# Altium schematic sheet agent-mother-sensor.SchDoc: TVMD Agent Controller Sensors
size A4; Author: Sciyen; DocumentNumber: 2; SheetNumber: 2; SheetTotal: 2
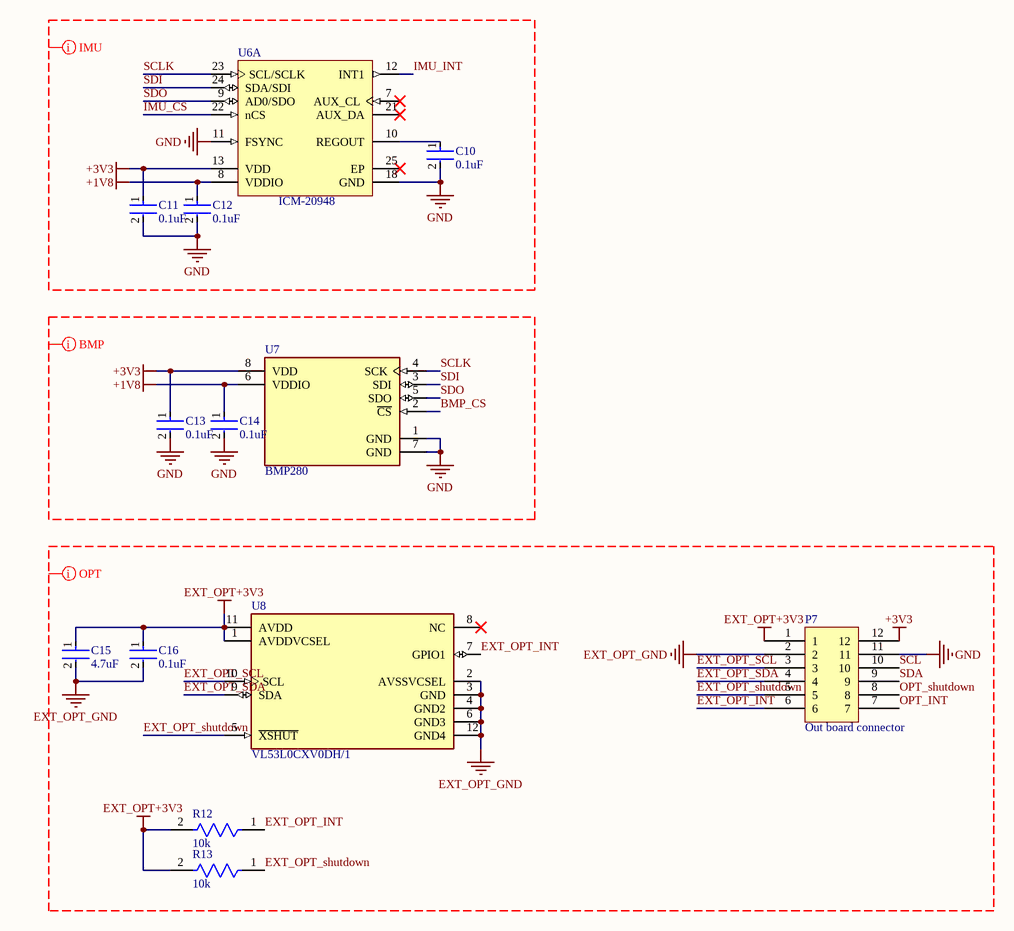
[diagram p0: agent-mother-sensor.SchDoc]

## Parts
C10  0.1uF  [FP-C0402-BB-MFG]
C11  0.1uF  [FP-C0402-BB-MFG]
C12  0.1uF  [FP-C0402-BB-MFG]
C13  0.1uF  [FP-C0402-BB-MFG]
C14  0.1uF  [FP-C0402-BB-MFG]
C15  4.7uF  [FP-C0402-BB-MFG]
C16  0.1uF  [FP-C0402-BB-MFG]
P7  Out board connector  [Edge Connector]
R12  10k  [FP-CRCW0402-e3-IPC_A]
R13  10k  [FP-CRCW0402-e3-IPC_A]
U6  ICM-20948  [TDK-QFN-24_L]  (part A of 2)
U7  BMP280  [FP-BMP280-MFG]
U8  VL53L0CXV0DH/1  [FP-LGA-12-MFG]

## Nets
+1V8: C12.1 C14.1 U6.8(VDDIO) U7.6(VDDIO)
+3V3: C11.1 C13.1 P7.12 U6.13(VDD) U7.8(VDD)
EXT_OPT+3V3: C15.1 C16.1 P7.1 R12.2 R13.2 U8.1(AVDDVCSEL) U8.11(AVDD)
EXT_OPT_GND: C15.2 C16.2 P7.2 U8.2(AVSSVCSEL) U8.3(GND) U8.4(GND2) U8.6(GND3) U8.12(GND4)
GND: C10.2 C11.2 C12.2 C13.2 C14.2 P7.11 U6.11(FSYNC) U6.18(GND) U7.1(GND) U7.7(GND)
BMP_CS: U7.2(~{CS})
EXT_OPT_INT: P7.6 R12.1 U8.7(GPIO1)
EXT_OPT_SCL: P7.3 U8.10(SCL)
EXT_OPT_SDA: P7.4 U8.9(SDA)
EXT_OPT_shutdown: P7.5 R13.1 U8.5(~{XSHUT})
IMU_CS: U6.22(nCS)
IMU_INT: U6.12(INT1)
OPT_INT: P7.7
OPT_shutdown: P7.8
SCL: P7.10
SCLK: U6.23(SCL/SCLK) U7.4(SCK)
SDA: P7.9
SDI: U6.24(SDA/SDI) U7.3(SDI)
SDO: U6.9(AD0/SDO) U7.5(SDO)
NetC10_1: C10.1 U6.10(REGOUT)

Not connected (* = marked no-connect by the designer): U6 7(AUX_CL)* 21(AUX_DA)* 25(EP)*; U8 8(NC)*

## Layout directives
net class IMU: +1V8, +3V3, GND, IMU_CS, IMU_INT, SCLK, SDI, SDO
net class BMP: +1V8, +3V3, BMP_CS, GND, SCLK, SDI, SDO
net class OPT: +3V3, EXT_OPT+3V3, EXT_OPT_GND, EXT_OPT_INT, EXT_OPT_SCL, EXT_OPT_SDA, EXT_OPT_shutdown, GND, OPT_INT, OPT_shutdown, SCL, SDA

## Library data of the parts
C10-C14 C16 = CMP-2008-02108-2: CAP CER 0.1uF 16V X7R 0402; Manufacturer: Kemet; Manufacturer Part Number: C0402C104K4RACTU; Tolerance: 0.1; Material: Ceramic; Temperature Coefficient: 15%; Voltage Rating: 16 V; Package: C0402-BB; Automotive: No; Ipc Land Pattern Name: CAPC10050X50; Device Class L3: Ceramic Capacitors; Value: 0.1uF; Capacitance: 0.1uF; Octopart: https://octopart.com/c0402c104k4ractu-kemet-94158; Temperature Characteristic: X7R; Mouser Description: Cap Ceramic 0.1uF 16V X7R 10% SMD 0402 125?C Paper T/R - Tape and Reel (Alt: C0402C104K4RAC TU); ComponentLink2Description: Datasheet; Temperature Range Low: -55°C; RoHS: TRUE; Device Class L1: Passive Components; Temperature Range High: +125°C; Device Class L2: Capacitors; ComponentLink2URL: https://content.kemet.com/datasheets/KEM_C1002_X7R_SMD.pdf; Category: Cap; Height: 0.55mm; Temperature: -55°C to +125°C; Lead Free: Yes; Digikey Description: CAP CER 0.1UF 16V X7R 0402
C15 = CMP-2008-02108-2: CAP CER 4.7uF 16V X7R 0402; Manufacturer: Kemet; Manufacturer Part Number: C0402C104K4RACTU; Value: 0.1uF; Tolerance: 0.1; Material: Ceramic; Temperature Coefficient: 15%; Voltage Rating: 16 V; Package: C0402-BB; Automotive: No; Ipc Land Pattern Name: CAPC10050X50; Device Class L3: Ceramic Capacitors; Capacitance: 0.1uF; Octopart: https://octopart.com/c0402c104k4ractu-kemet-94158; Temperature Characteristic: X7R; Mouser Description: Cap Ceramic 0.1uF 16V X7R 10% SMD 0402 125?C Paper T/R - Tape and Reel (Alt: C0402C104K4RAC TU); ComponentLink2Description: Datasheet; Temperature Range Low: -55°C; RoHS: TRUE; Device Class L1: Passive Components; Temperature Range High: +125°C; Device Class L2: Capacitors; ComponentLink2URL: https://content.kemet.com/datasheets/KEM_C1002_X7R_SMD.pdf; Category: Cap; Height: 0.55mm; Temperature: -55°C to +125°C; Lead Free: Yes; Digikey Description: CAP CER 0.1UF 16V X7R 0402
P7 = Out board connector: 6 pins pcb connector
R12 R13 = CMP-2002-08122-2: RES Thick Film, 10kΩ, 0.063W, 0402; Tolerance: 5%; Max Power Dissipation: 63mW; Voltage Rating: 50V; Temperature Coefficient: 100ppm/°C; Resistance: 5k1; Contact Plating: Tin; Height: 0.35mm; Radiation Hardening: No; Features: Automotive AEC-Q200; Composition: Thick Film; Width: 0.5mm; Weight: 2.3E-05oz; Termination: SMD/SMT; Packaging: Tape and Reel; Mount: Surface Mount; Case Code (Metric): 1005; Military Standard: Not; Min Operating Temperature: -55°C; Number of Terminations: 2; Package Quantity: 1; Case Code (Imperial): 0402; Depth: 0.5mm; Max Operating Temperature: 155°C; Case/Package: 0402; Power Rating: 63mW; Lead Free: Lead Free; Voltage Rating (DC): 50V; Length: 1mm
U6 = CMP-2000-07532-1: World’s Lowest Power 9-Axis MEMS MotionTracking(TM) Device, 1.71 to 3.6 V, -40 to 85 degC, 24-Pin QFN, RoHS, Tape and Reel; Manufacturer: TDK; Package Description: 24-Pin Quad Flat No-lead Package, Body 3 x 3 mm, Pitch 0.4 mm; Datasheet Version: Rev. 1.3, 06/2017; Package Reference: QFN-24; Mounting Technology: SurfaceMount; Datasheet URL: https://www.invensense.com/wp-content/uploads/2016/06/DS-000189-ICM-20948-v1.3.pdf; Manufacturer URL: http://www.tdk.com/
U7 = CMP-2000-05076-3: SENSOR PRESSURE ABS; Operating Pressure: 15.95PSI; Pressure Type: Absolute; Output Type: SPI; Max Pressure: 290.08PSI; Port Style: No Port; Case/Package: SMD/SMT; Lead Free: Lead Free; Termination: SMD/SMT; Min Operating Temperature: -40°C; Number of Pins: 8; Max Operating Temperature: 85°C
U8 = CMP-2000-07484-2: SENSOR OPTICAL 200CM I2C; Manufacturer: STMicroelectronics; Operating Supply Current: 0.016-19mA; Max Supply Voltage: 3.5V; Min Supply Voltage: 1.6V; Height: 1.05mm; Package: LGA-12; Digikey Description: SENSOR OPTICAL 200CM I2C; Device Class L1: Sensors; Device Class L2: Optical Sensors; Temperature Range High: +70°C; Sensor Output: I2C; ComponentLink2URL: https://www.st.com/resource/en/datasheet/vl53l0x.pdf; RoHS: TRUE; Temperature: -20°C to +70°C; Device Class L3: unset; Lead Free: Yes; Temperature Range Low: -20°C; Category: IC; Manufacturer Part Number: VL53L0CXV0DH/1; ComponentLink2Description: Datasheet; Octopart: https://octopart.com/vl53l0cxv0dh%2F1-stmicroelectronics-71168165; Automotive: No